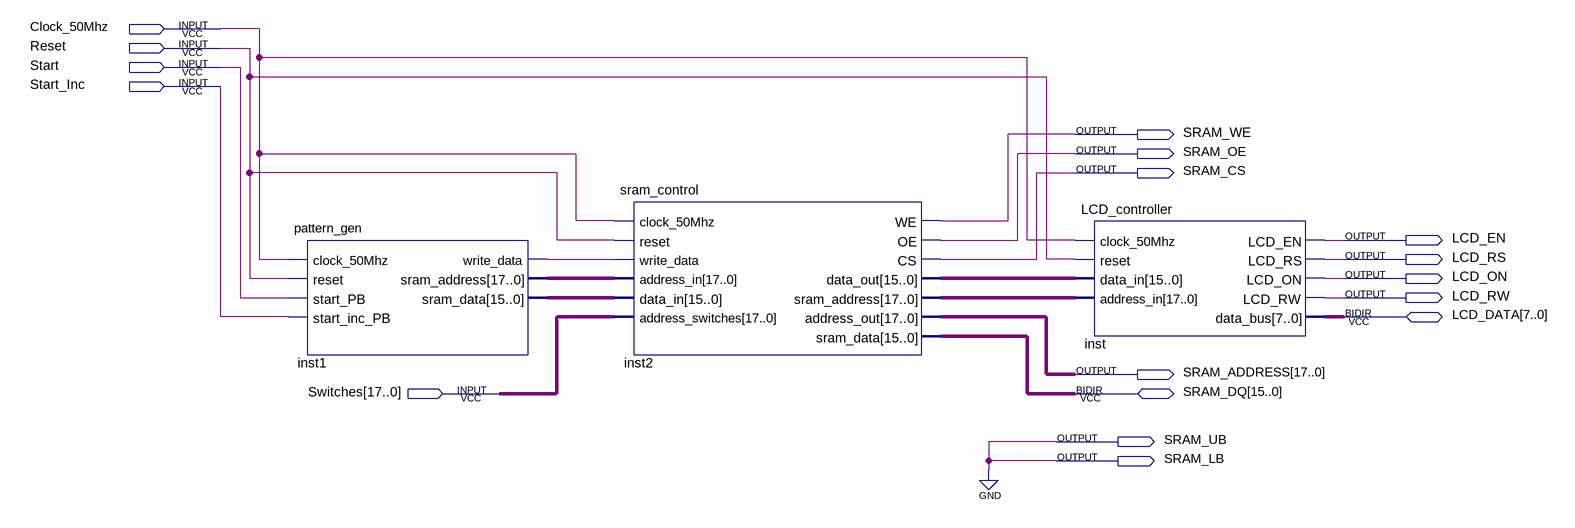
[diagram p0: schematic sheet]
// Quartus schematic top_level.bdf as structural Verilog: 3 symbols, 17 pins
module top_level (
  input  Clock_50Mhz,
  input  Reset,
  input  Start,
  input  Start_Inc,
  input  [17:0] Switches,
  inout  [7:0] LCD_DATA,
  inout  [15:0] SRAM_DQ,
  output SRAM_WE,
  output SRAM_OE,
  output SRAM_CS,
  output LCD_EN,
  output LCD_RS,
  output LCD_ON,
  output LCD_RW,
  output [17:0] SRAM_ADDRESS,
  output SRAM_UB,
  output SRAM_LB
);

  wire inst1_write_data;
  wire [15:0] inst1_sram_data, inst2_data_out;
  wire [17:0] inst1_sram_address, inst2_sram_address;

  pattern_gen inst1 (
    .clock_50Mhz(Clock_50Mhz), .reset(Reset), .start_PB(Start), .start_inc_PB(Start_Inc),
    .write_data(inst1_write_data), .sram_address(inst1_sram_address), .sram_data(inst1_sram_data));
  sram_control inst2 (
    .clock_50Mhz(Clock_50Mhz), .reset(Reset), .write_data(inst1_write_data), .address_in(inst1_sram_address),
    .data_in(inst1_sram_data), .address_switches(Switches), .WE(SRAM_WE), .OE(SRAM_OE), .CS(SRAM_CS),
    .data_out(inst2_data_out), .sram_address(inst2_sram_address), .address_out(SRAM_ADDRESS),
    .sram_data(SRAM_DQ));
  LCD_controller inst (
    .clock_50Mhz(Clock_50Mhz), .reset(Reset), .data_in(inst2_data_out), .address_in(inst2_sram_address),
    .LCD_EN(LCD_EN), .LCD_RS(LCD_RS), .LCD_ON(LCD_ON), .LCD_RW(LCD_RW), .data_bus(LCD_DATA));

  assign SRAM_LB = 1'b0;
  assign SRAM_UB = 1'b0;
endmodule
